# Altium project PCB_Project.PrjPcb
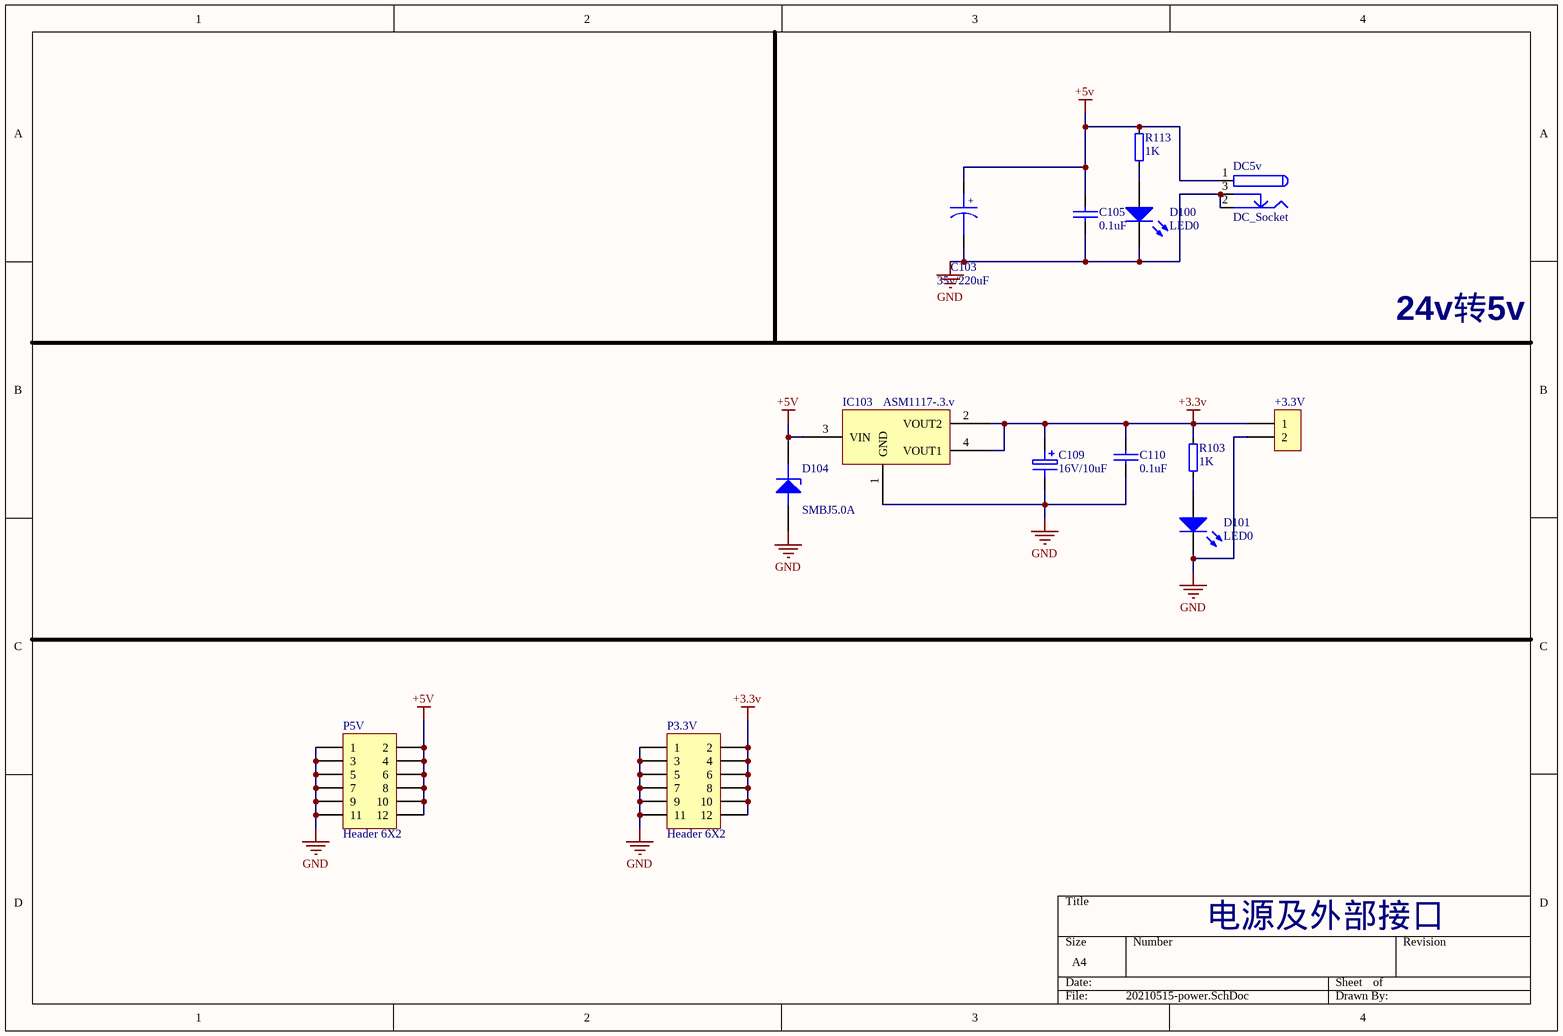
[diagram p0: 20210515-power.SchDoc]
1 sheet, 14 parts. Net scope: global (net labels, ports and power ports of the same name join across sheets).
Board file: 20150517-F103CONTROL-dcmotor.PcbDoc

## Sheet 20210515-power.SchDoc
size A4

### Parts
+3.3V  (no value)  [XH2/2.54mm/90]
C103  35v/220uF  [100uF/25V]
C105  0.1uF  [C0805]
C109  16V/10uF  [100uF/25V]
C110  0.1uF  [C0805]
D100  LED0  [1210 LED封装]
D101  LED0  [1210 LED封装]
D104  SMBJ5.0A  [SMB]
DC5v  DC_Socket  [DC-005]
IC103  ASM1117-.3.v  [SOT223]
P3.3V  Header 6X2  [HDR2X6]
P5V  Header 6X2  [HDR2X6]
R103  1K  [1206R]
R113  1K  [1206R]

### Nets
+3.3v: +3.3V.1 C109.1 C110.1 IC103.2(VOUT2) IC103.4(VOUT1) P3.3V.2 P3.3V.4 P3.3V.6 P3.3V.8 P3.3V.10 P3.3V.12 R103.2
+5v: C103.1 C105.1 D104.2(K) DC5v.1 IC103.3(VIN) P5V.2 P5V.4 P5V.6 P5V.8 P5V.10 P5V.12 R113.2
GND: +3.3V.2 C103.2 C105.2 C109.2(E) C110.2 D100.2(K) D101.2(K) D104.1(A) DC5v.2 DC5v.3 IC103.1(GND) P3.3V.1 P3.3V.3 P3.3V.5 P3.3V.7 P3.3V.9 P3.3V.11 P5V.1 P5V.3 P5V.5 P5V.7 P5V.9 P5V.11
NetD100_1: D100.1(A) R113.1
NetD101_1: D101.1(A) R103.1

### Notes on the sheet
- 24v转5v
- 电源及外部接口
- (in symbol 电解电容) +

### Library data of the parts
+3.3V = CON2: Connector
C103 = 电解电容
C105 C110 = 贴片电容
C109 = 钽电容
D100 D101 = LED0: Typical INFRARED GaAs LED; Published: 8-Jun-2000; LatestRevisionDate: 08-Jul-2005; LatestRevisionNote: Mech Layer 1 removed.; PackageReference: LED-0; Publisher: Altium Limited; PackageDescription: LED; 2 Leads
D104 = 贴片稳压二极管
IC103 = ASM1117
P3.3V P5V = Header 6X2: Header, 6-Pin, Dual row; LatestRevisionDate: 17-Jul-2002; LatestRevisionNote: Re-released for DXP Platform.; Publisher: Altium Limited
R103 R113 = 贴片电阻